# Altium project PRJ_SiAlarmV1.PrjPcb
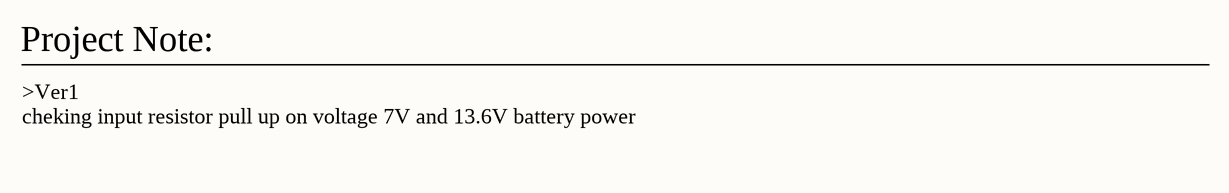
[diagram p0: ProjectNote1.SchDoc]
7 sheets, 31 parts. Net scope: flat (ports and power ports of the same name join across sheets).
Board file: pcb_SiAlarmV1.PcbDoc
Sheets:
  ProjectNote1.SchDoc
  sch_audio.SchDoc
  sch_io.SchDoc
  sch_gsm.SchDoc
  sch_controller.SchDoc
  sch_power.SchDoc
  SiAlarm_BlockDiagram.SchDoc

## Sheet ProjectNote1.SchDoc
size 241 x 381 mm; SheetNumber: 1; SheetTotal: 6

### Notes on the sheet
- Project Note:
- >Ver1
  cheking input resistor pull up on voltage 7V and 13.6V battery power
- Note:

## Sheet sch_audio.SchDoc
size B; SheetNumber: 2; SheetTotal: 7
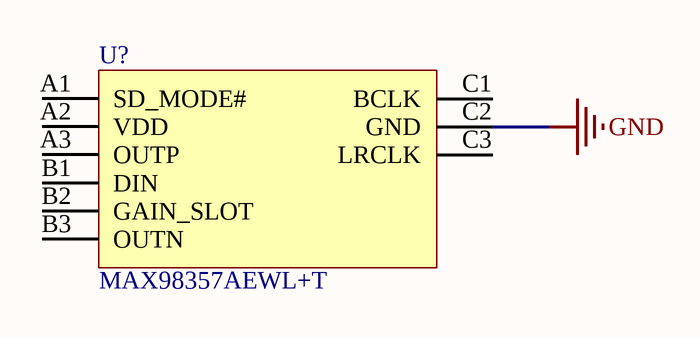
[diagram p1: sch_audio.SchDoc]

### Parts
(Parts that share a designator on the sheet are numbered #1, #2 ... from top to bottom, then left to right.)
U?#1  MAX98357AEWL+T  [WLP-9_L1.4-W1.3-P0.40-R3-C3-BR]

### Nets
GND: U?#1.C2(GND)

Not connected (* = marked no-connect by the designer): U?#1 A1(SD_MODE#) A2(VDD) A3(OUTP) B1(DIN) B2(GAIN_SLOT) B3(OUTN) C1(BCLK) C3(LRCLK)

### Library data of the parts
U?#1 = MAX98357AEWL+T: JLC: C2682619; MFAC: MAX98357AEWL+T

## Sheet sch_io.SchDoc
size B; SheetNumber: 3; SheetTotal: 7
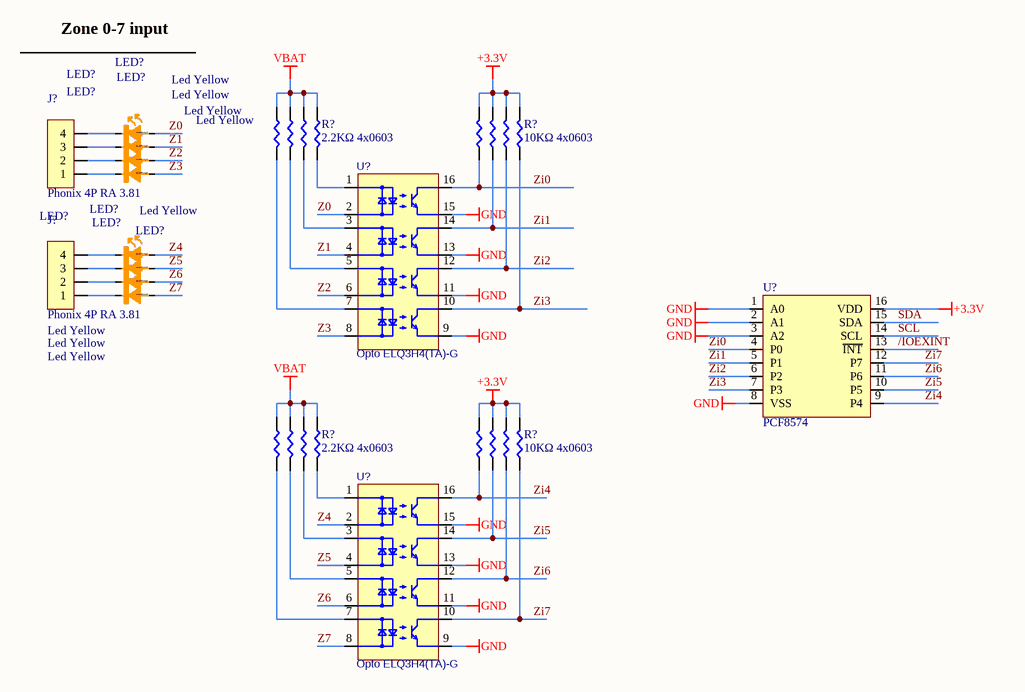
[diagram p2: sch_io.SchDoc]

### Parts
(Parts that share a designator on the sheet are numbered #1, #2 ... from top to bottom, then left to right.)
J?#1  Phonix 4P RA 3.81  [TER4-R-3.81]
J?#2  Phonix 4P RA 3.81  [TER4-R-3.81]
LED?#1  Led Yellow  [LED0603Y]
LED?#2  Led Yellow  [LED0603Y]
LED?#3  Led Yellow  [LED0603Y]
LED?#4  Led Yellow  [LED0603Y]
LED?#5  Led Yellow  [LED0603Y]
LED?#6  Led Yellow  [LED0603Y]
LED?#7  Led Yellow  [LED0603Y]
LED?#8  Led Yellow  [LED0603Y]
R?#1  2.2KΩ 4x0603  [0603ARRAY]
R?#2  10KΩ 4x0603  [0603ARRAY]
R?#3  2.2KΩ 4x0603  [0603ARRAY]
R?#4  10KΩ 4x0603  [0603ARRAY]
U?#2  Opto ELQ3H4(TA)-G  [SOP-16_L10.3-W4.4-P1.27-LS7.0-BL]
U?#3  PCF8574  [SOIC-16_L10.3-W7.5-P1.27-LS10.3-BL]
U?#4  Opto ELQ3H4(TA)-G  [SOP-16_L10.3-W4.4-P1.27-LS7.0-BL]

### Nets
+3.3V: R?#2.5(R5) R?#2.6(R6) R?#2.7(R7) R?#2.8(R8) R?#4.5(R5) R?#4.6(R6) R?#4.7(R7) R?#4.8(R8) U?#3.16(VDD)
GND: U?#2.9(EMI1) U?#2.11(EMI2) U?#2.13(EMI3) U?#2.15(EMI4) U?#3.1(A0) U?#3.2(A1) U?#3.3(A2) U?#3.8(VSS) U?#4.9(EMI1) U?#4.11(EMI2) U?#4.13(EMI3) U?#4.15(EMI4)
VBAT: R?#1.5(R5) R?#1.6(R6) R?#1.7(R7) R?#1.8(R8) R?#3.5(R5) R?#3.6(R6) R?#3.7(R7) R?#3.8(R8)
/IOEXINT: U?#3.13(~{INT})
SCL: U?#3.14(SCL)
SDA: U?#3.15(SDA)
Z0: LED?#1.A U?#2.2(C-A1)
Z1: LED?#2.A U?#2.4(C-A2)
Z2: LED?#3.A U?#2.6(C-A3)
Z3: LED?#4.A U?#2.8(C-A4)
Z4: LED?#5.A U?#4.2(C-A1)
Z5: LED?#6.A U?#4.4(C-A2)
Z6: LED?#7.A U?#4.6(C-A3)
Z7: LED?#8.A U?#4.8(C-A4)
Zi0: R?#2.4(R4) U?#2.16(COL4) U?#3.4(P0)
Zi1: R?#2.3(R3) U?#2.14(COL3) U?#3.5(P1)
Zi2: R?#2.2(R2) U?#2.12(CO2) U?#3.6(P2)
Zi3: R?#2.1(R1) U?#2.10(COL1) U?#3.7(P3)
Zi4: R?#4.4(R4) U?#3.9(P4) U?#4.16(COL4)
Zi5: R?#4.3(R3) U?#3.10(P5) U?#4.14(COL3)
Zi6: R?#4.2(R2) U?#3.11(P6) U?#4.12(CO2)
Zi7: R?#4.1(R1) U?#3.12(P7) U?#4.10(COL1)
NetJ?#1_1: J?#1.1 LED?#4.K
NetJ?#1_2: J?#1.2 LED?#3.K
NetJ?#1_3: J?#1.3 LED?#2.K
NetJ?#1_4: J?#1.4 LED?#1.K
NetJ?#2_1: J?#2.1 LED?#8.K
NetJ?#2_2: J?#2.2 LED?#7.K
NetJ?#2_3: J?#2.3 LED?#6.K
NetJ?#2_4: J?#2.4 LED?#5.K
NetR?#1_1: R?#1.1(R1) U?#2.7(A-C4)
NetR?#1_2: R?#1.2(R2) U?#2.5(A-C3)
NetR?#1_3: R?#1.3(R3) U?#2.3(A-C2)
NetR?#1_4: R?#1.4(R4) U?#2.1(A-C1)
NetR?#3_1: R?#3.1(R1) U?#4.7(A-C4)
NetR?#3_2: R?#3.2(R2) U?#4.5(A-C3)
NetR?#3_3: R?#3.3(R3) U?#4.3(A-C2)
NetR?#3_4: R?#3.4(R4) U?#4.1(A-C1)

### Notes on the sheet
- Zone 0-7 input
- (in symbol LedYellow) @DesignPCB

### Library data of the parts
J?#1 J?#2 = Phonix 4P RA: MFAC: DB2ERC-3.81-4P-GN; JLC: C395698
LED?#1-LED?#8 = LedYellow: MFAC: XL-1608UWC-04; JLC: C965808
R?#1 R?#3 = R2.2K Array: MFAC: 4D03WGJ0222T5E; JLC: C12001
R?#2 R?#4 = R10K Array: MFAC: 4D03WGJ0103T5E; JLC: C29718
U?#2 U?#4 = ELQ3H4(TA)-G: JLC: C150957; MFAC: ELQ3H4(TA)-G
U?#3 = PCF8574: MFAC: PCF8574T/3,518; JLC: C7605

## Sheet sch_gsm.SchDoc
size B; SheetNumber: 4; SheetTotal: 7
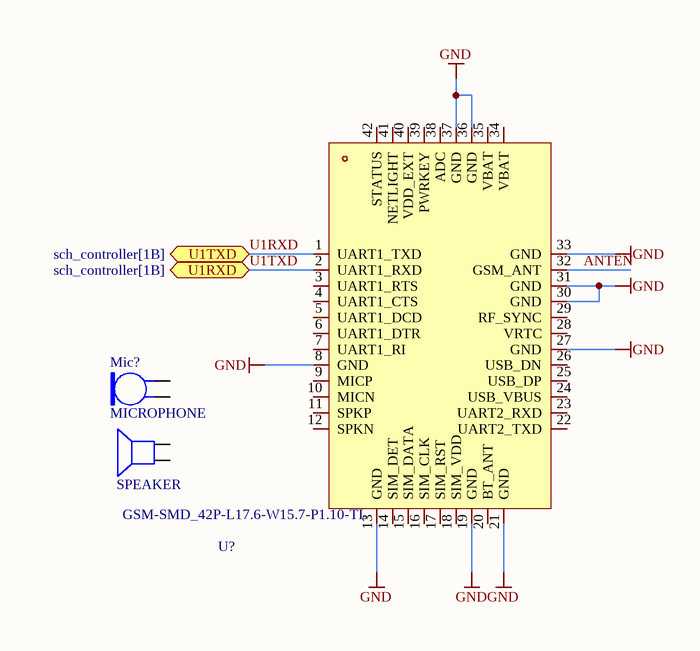
[diagram p3: sch_gsm.SchDoc]

### Parts
(Parts that share a designator on the sheet are numbered #1, #2 ... from top to bottom, then left to right.)
?  SPEAKER
Mic?  MICROPHONE  [Model Name]
U?#5  GSM-SMD_42P-L17.6-W15.7-P1.10-TL  [GSM-SMD_42P-L17.6-W15.7-P1.10-TL]

### Ports
U1RXD (bidir, see sch_controller[1B]), U1TXD (bidir, see sch_controller[1B])

### Nets
GND: U?#5.8(GND) U?#5.13(GND) U?#5.19(GND) U?#5.21(GND) U?#5.27(GND) U?#5.30(GND) U?#5.31(GND) U?#5.33(GND) U?#5.36(GND) U?#5.37(GND)
ANTEN: U?#5.32(GSM_ANT)
U1RXD: U?#5.1(UART1_TXD) ; port U1TXD
U1TXD: U?#5.2(UART1_RXD) ; port U1RXD  [project net U1RXD]

Not connected (* = marked no-connect by the designer): ? 1 2; Mic? 1 2; U?#5 3(UART1_RTS) 4(UART1_CTS) 5(UART1_DCD) 6(UART1_DTR) 7(UART1_RI) 9(MICP) 10(MICN) 11(SPKP) 12(SPKN) 14(SIM_DET) 15(SIM_DATA) 16(SIM_CLK) 17(SIM_RST) 18(SIM_VDD) 20(BT_ANT) 22(UART2_TXD) 23(UART2_RXD) 24(USB_VBUS) 25(USB_DP) 26(USB_DN) 28(VRTC) 29(RF_SYNC) 34(VBAT) 35(VBAT) 38(ADC) 39(PWRKEY) 40(VDD_EXT) 41(NETLIGHT) 42(STATUS)

### Library data of the parts
U?#5 = SIM800C_C2981431: MFAC: SIM800C; JLC: C2981431

## Sheet sch_controller.SchDoc
size B; SheetNumber: 5; SheetTotal: 7
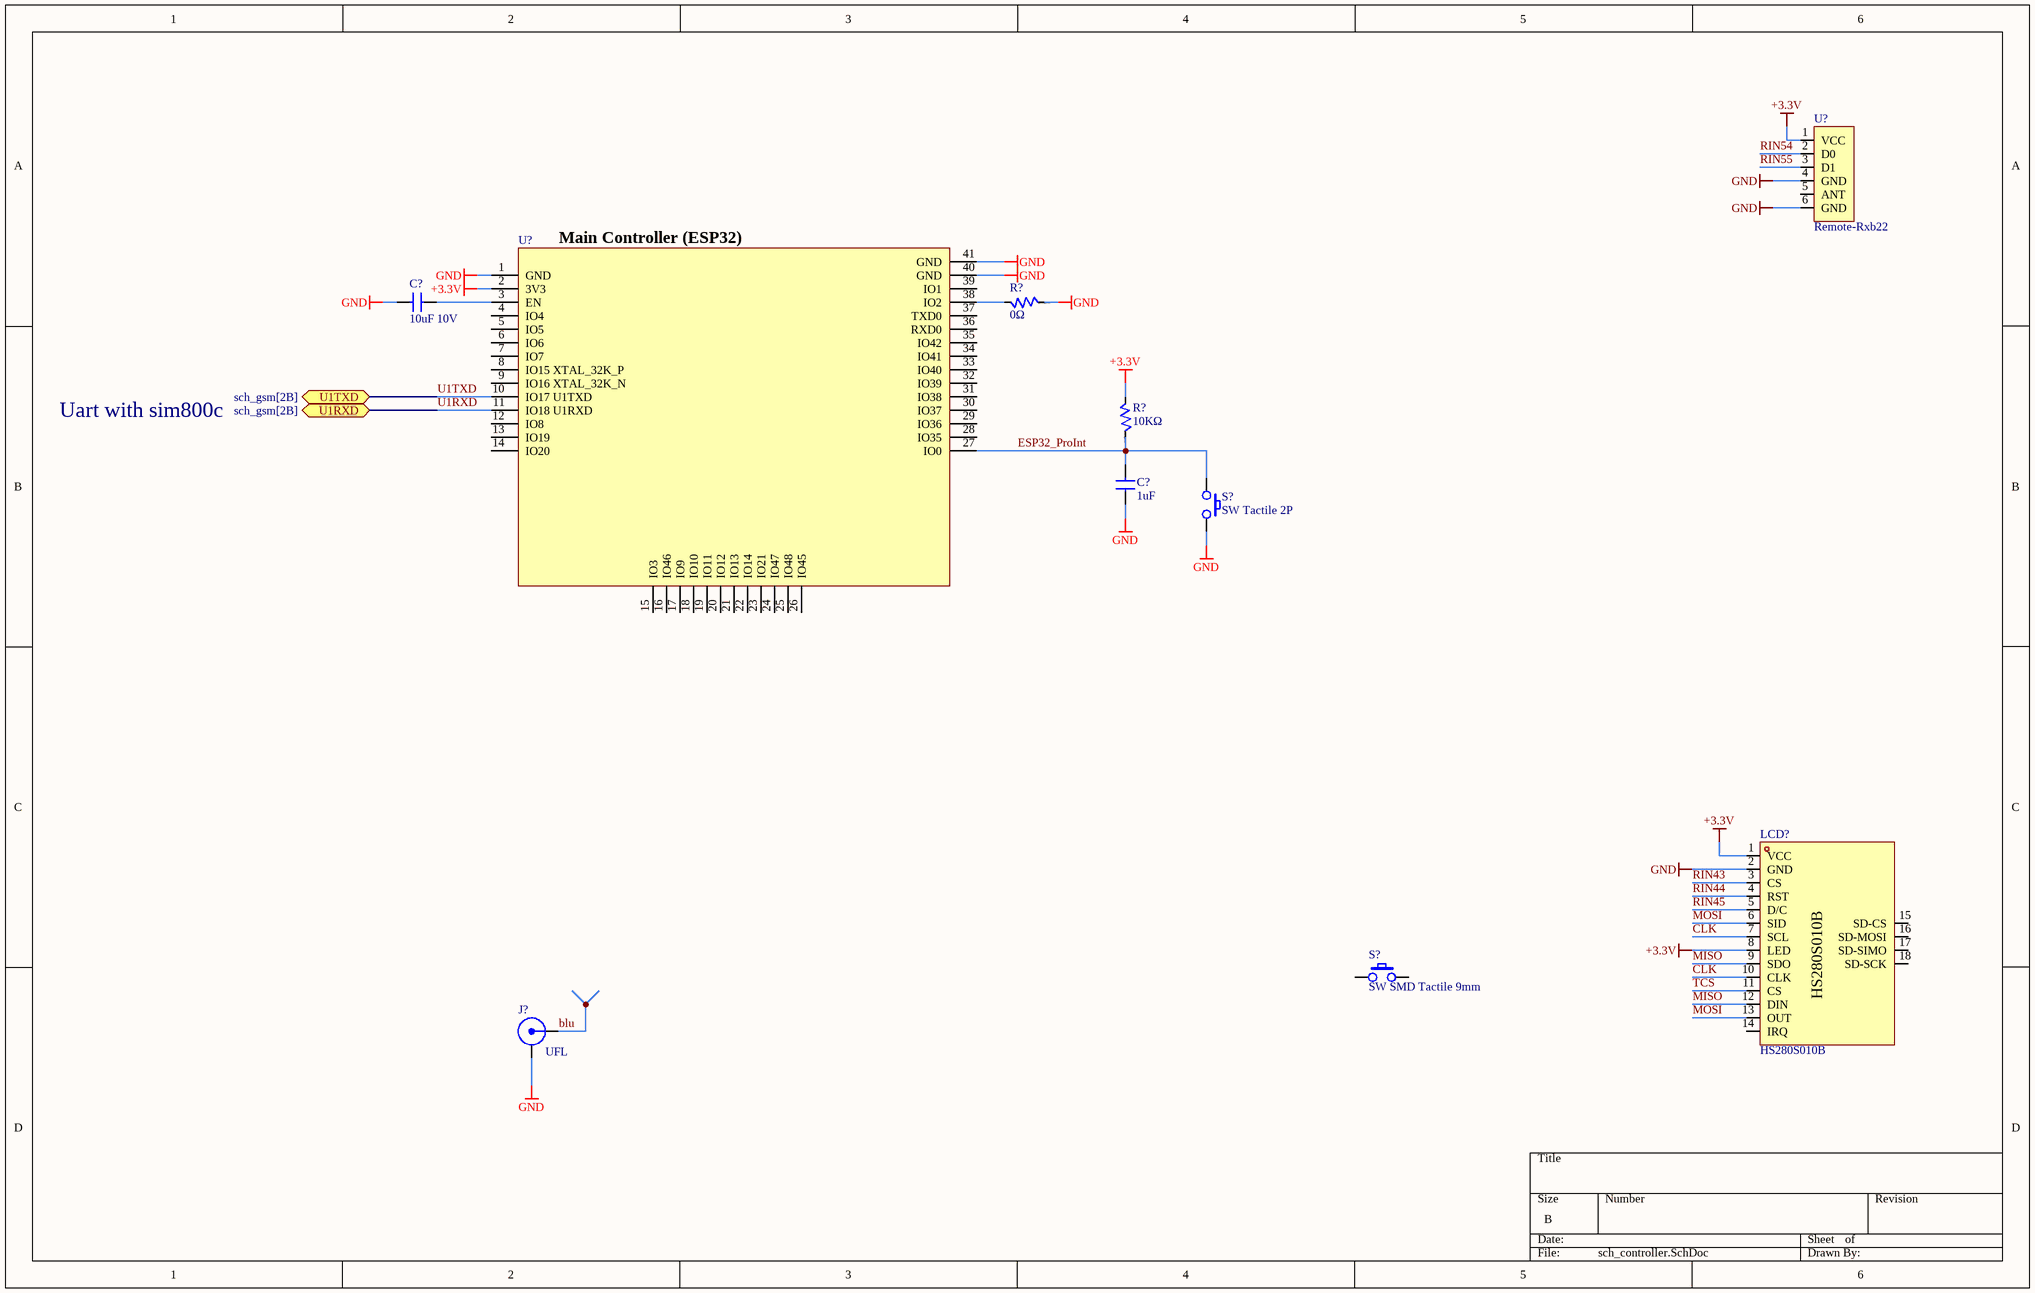
[diagram p4: sch_controller.SchDoc]

### Parts
(Parts that share a designator on the sheet are numbered #1, #2 ... from top to bottom, then left to right.)
C?#1  10uF 10V  [0603]
C?#2  1uF  [0402]
J?#3  UFL  [UFL]
LCD?  HS280S010B  [LCD-TH_HS280S010B]
R?#5  0Ω  [0603]
R?#6  10KΩ  [0402]
S?#1  SW Tactile 2P  [SW-SMD_L6.0-W3.3-LS8.0]
S?#2  SW SMD Tactile 9mm  [SW SMD_4P-L4.5-W4.5-P3.00-LS7.0]
U?#6  Remote-Rxb22  [remote-rxb22-433]
U?#7  (no value)  [WIRELM-SMD_ESP32-S3-WROOM-1U]

### Ports
U1RXD (bidir, see sch_gsm[2B]), U1TXD (bidir, see sch_gsm[2B])

### Nets
+3.3V: LCD?.1(VCC) LCD?.8(LED) R?#6.2 U?#6.1(VCC) U?#7.2(3V3)
GND: C?#1.2 C?#2.2 J?#3.2 LCD?.2(GND) R?#5.1 S?#1.1 U?#6.4(GND) U?#6.6(GND) U?#7.1(GND) U?#7.40(GND) U?#7.41(GND)
blu: J?#3.1
CLK: LCD?.7(SCL) LCD?.10(CLK)
ESP32_ProInt: C?#2.1 R?#6.1 S?#1.2 U?#7.27(IO0)
MISO: LCD?.9(SDO) LCD?.12(DIN)
MOSI: LCD?.6(SID) LCD?.13(OUT)
RIN43: LCD?.3(CS)
RIN44: LCD?.4(RST)
RIN45: LCD?.5(D/C)
RIN54: U?#6.2(D0)
RIN55: U?#6.3(D1)
TCS: LCD?.11(CS)
U1RXD: U?#7.11(IO18_U1RXD) ; port U1RXD
U1TXD: U?#7.10(IO17_U1TXD) ; port U1TXD  [project net U1RXD]
NetC?#1_1: C?#1.1 U?#7.3(EN)
NetR?#5_2: R?#5.2 U?#7.38(IO2)

Not connected (* = marked no-connect by the designer): LCD? 14(IRQ) 15(SD-CS) 16(SD-MOSI) 17(SD-SIMO) 18(SD-SCK); S?#2 1 2; U?#6 5(ANT); U?#7 4(IO4) 5(IO5) 6(IO6) 7(IO7) 8(IO15_XTAL_32K_P) 9(IO16_XTAL_32K_N) 12(IO8) 13(IO19) 14(IO20) 15(IO3) 16(IO46) 17(IO9) 18(IO10) 19(IO11) 20(IO12) 21(IO13) 22(IO14) 23(IO21) 24(IO47) 25(IO48) 26(IO45) 28(IO35) 29(IO36) 30(IO37) 31(IO38) 32(IO39) 33(IO40) 34(IO41) 35(IO42) 36(RXD0) 37(TXD0) 39(IO1)

### Notes on the sheet
- (near U?#7) Main Controller (ESP32)
- Uart with sim800c
- (in symbol R0R) @DesignPCB
- (in symbol R10K0402) @DesignPCB

### Library data of the parts
C?#1 = C10UF 10V: MFAC: CL10A106KP8NNNC; JLC: C19702
C?#2 = C1uF0402 25V: MFAC: CL05A105KA5NQNC; JLC: C52923
J?#3 = BNC
LCD? = LCD-TH_HS280S010B: MFAC: HS280S010B; JLC: C2939938
R?#5 = R0R: MFAC: 0603WAF0000T5E; JLC: C21189
R?#6 = R10K0402: MFAC: RC0402FR-0710KL; JLC: C60490
S?#1 = SW Tactile Reset 2P: MFAC: TS-1101-C-W; JLC: C318938
S?#2 = SW Push 9mm: MFAC: TS-1109S-C-L; JLC: C840835
U?#7 = ESP32-S3-WROOM-1U-N16R8: MFAC: ESP32-S3-WROOM-1U-N16R8; JLC: C3013946

## Sheet sch_power.SchDoc
size B; SheetNumber: 1; SheetTotal: 1

## Sheet SiAlarm_BlockDiagram.SchDoc
size D; SheetNumber: 7; SheetTotal: 7
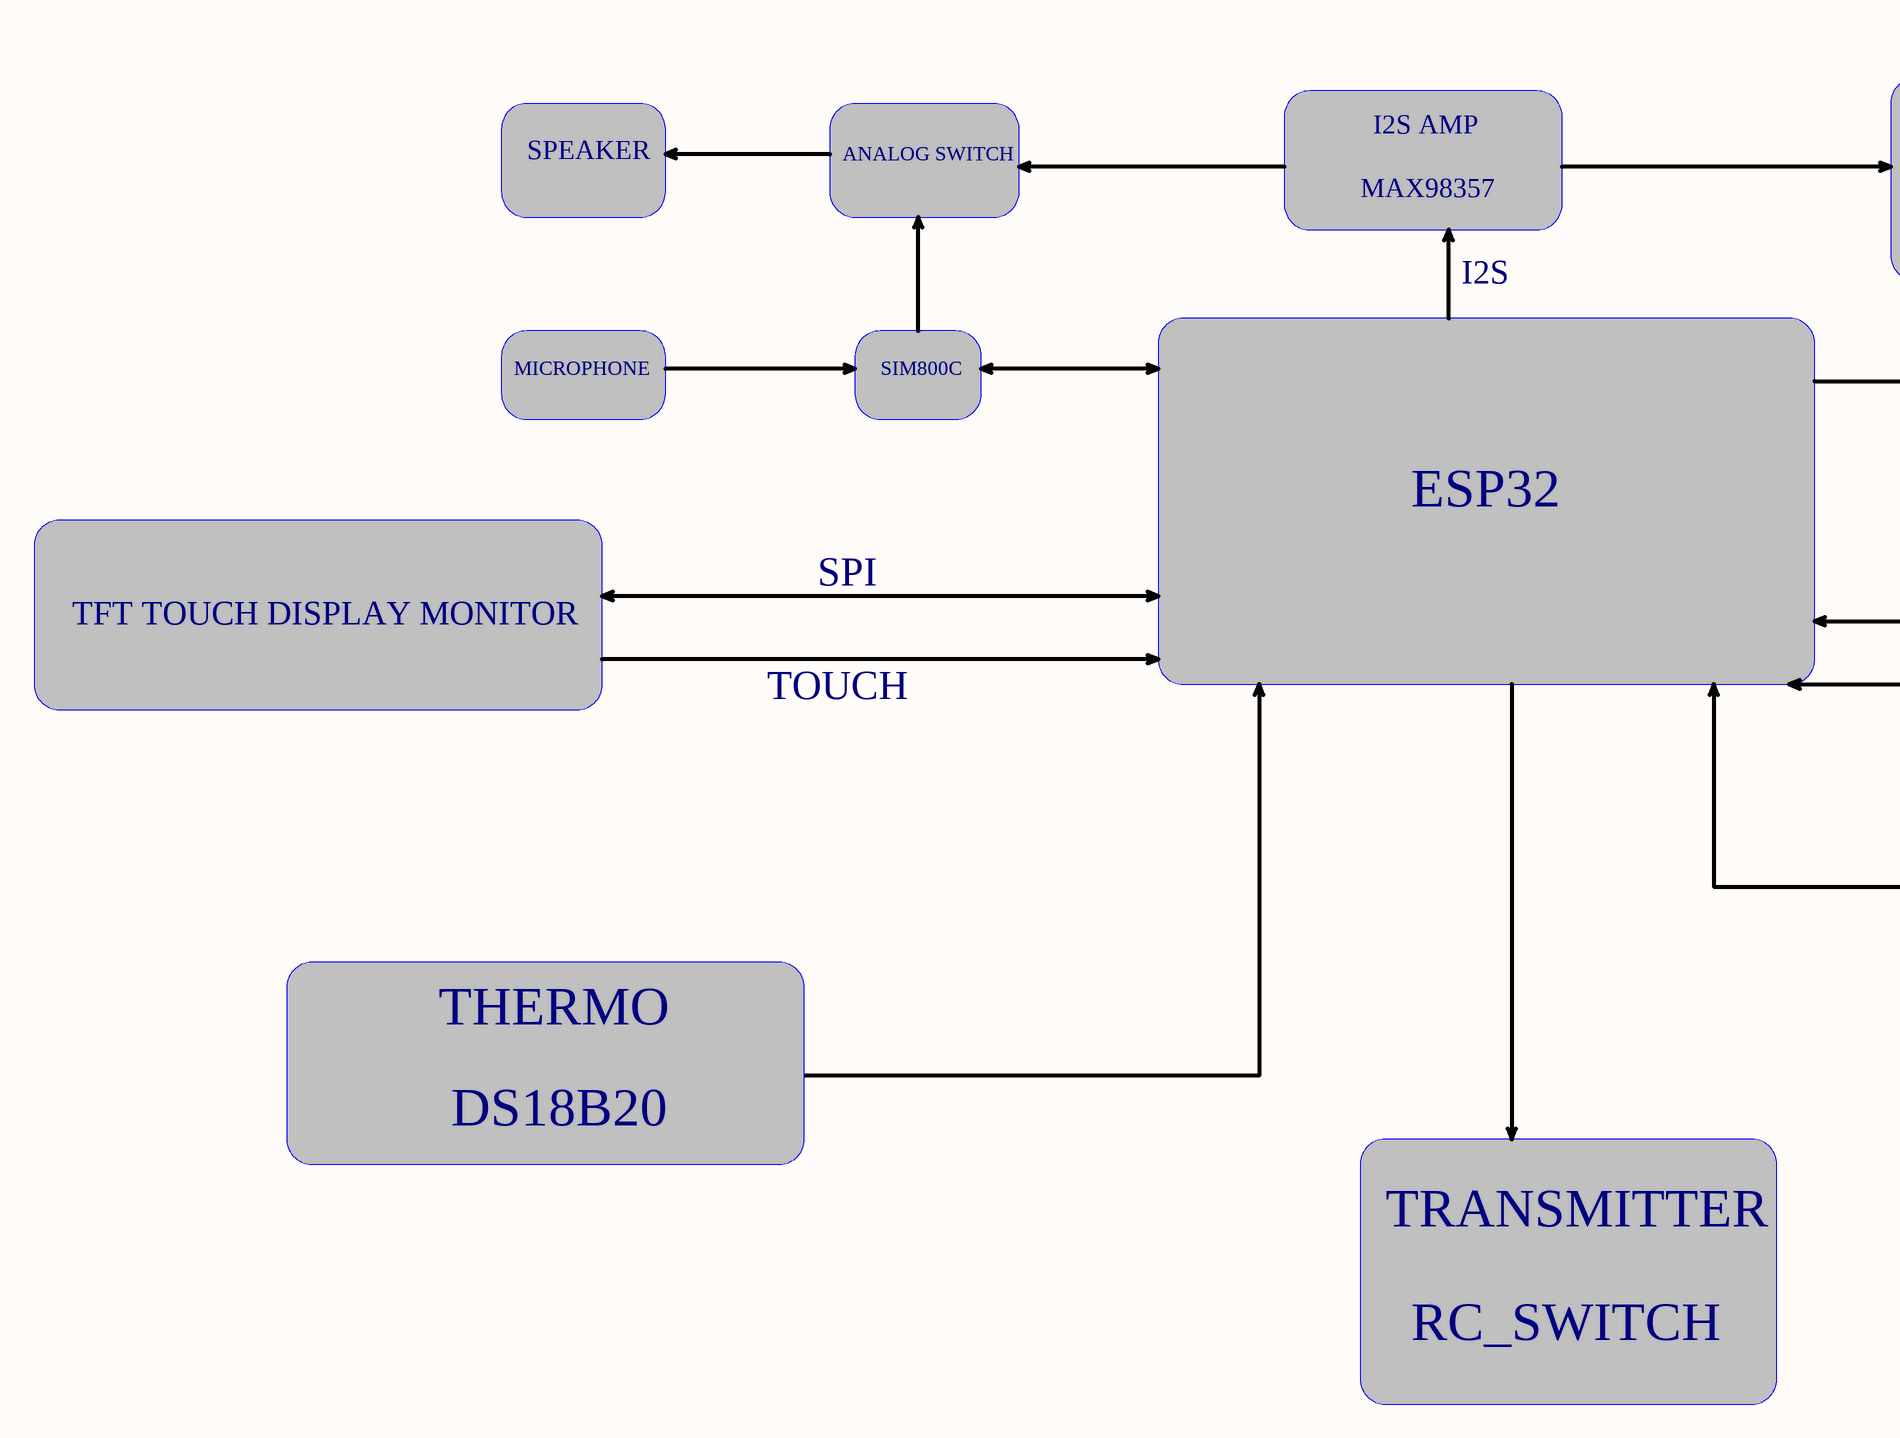
[diagram p5: SiAlarm_BlockDiagram.SchDoc, left]
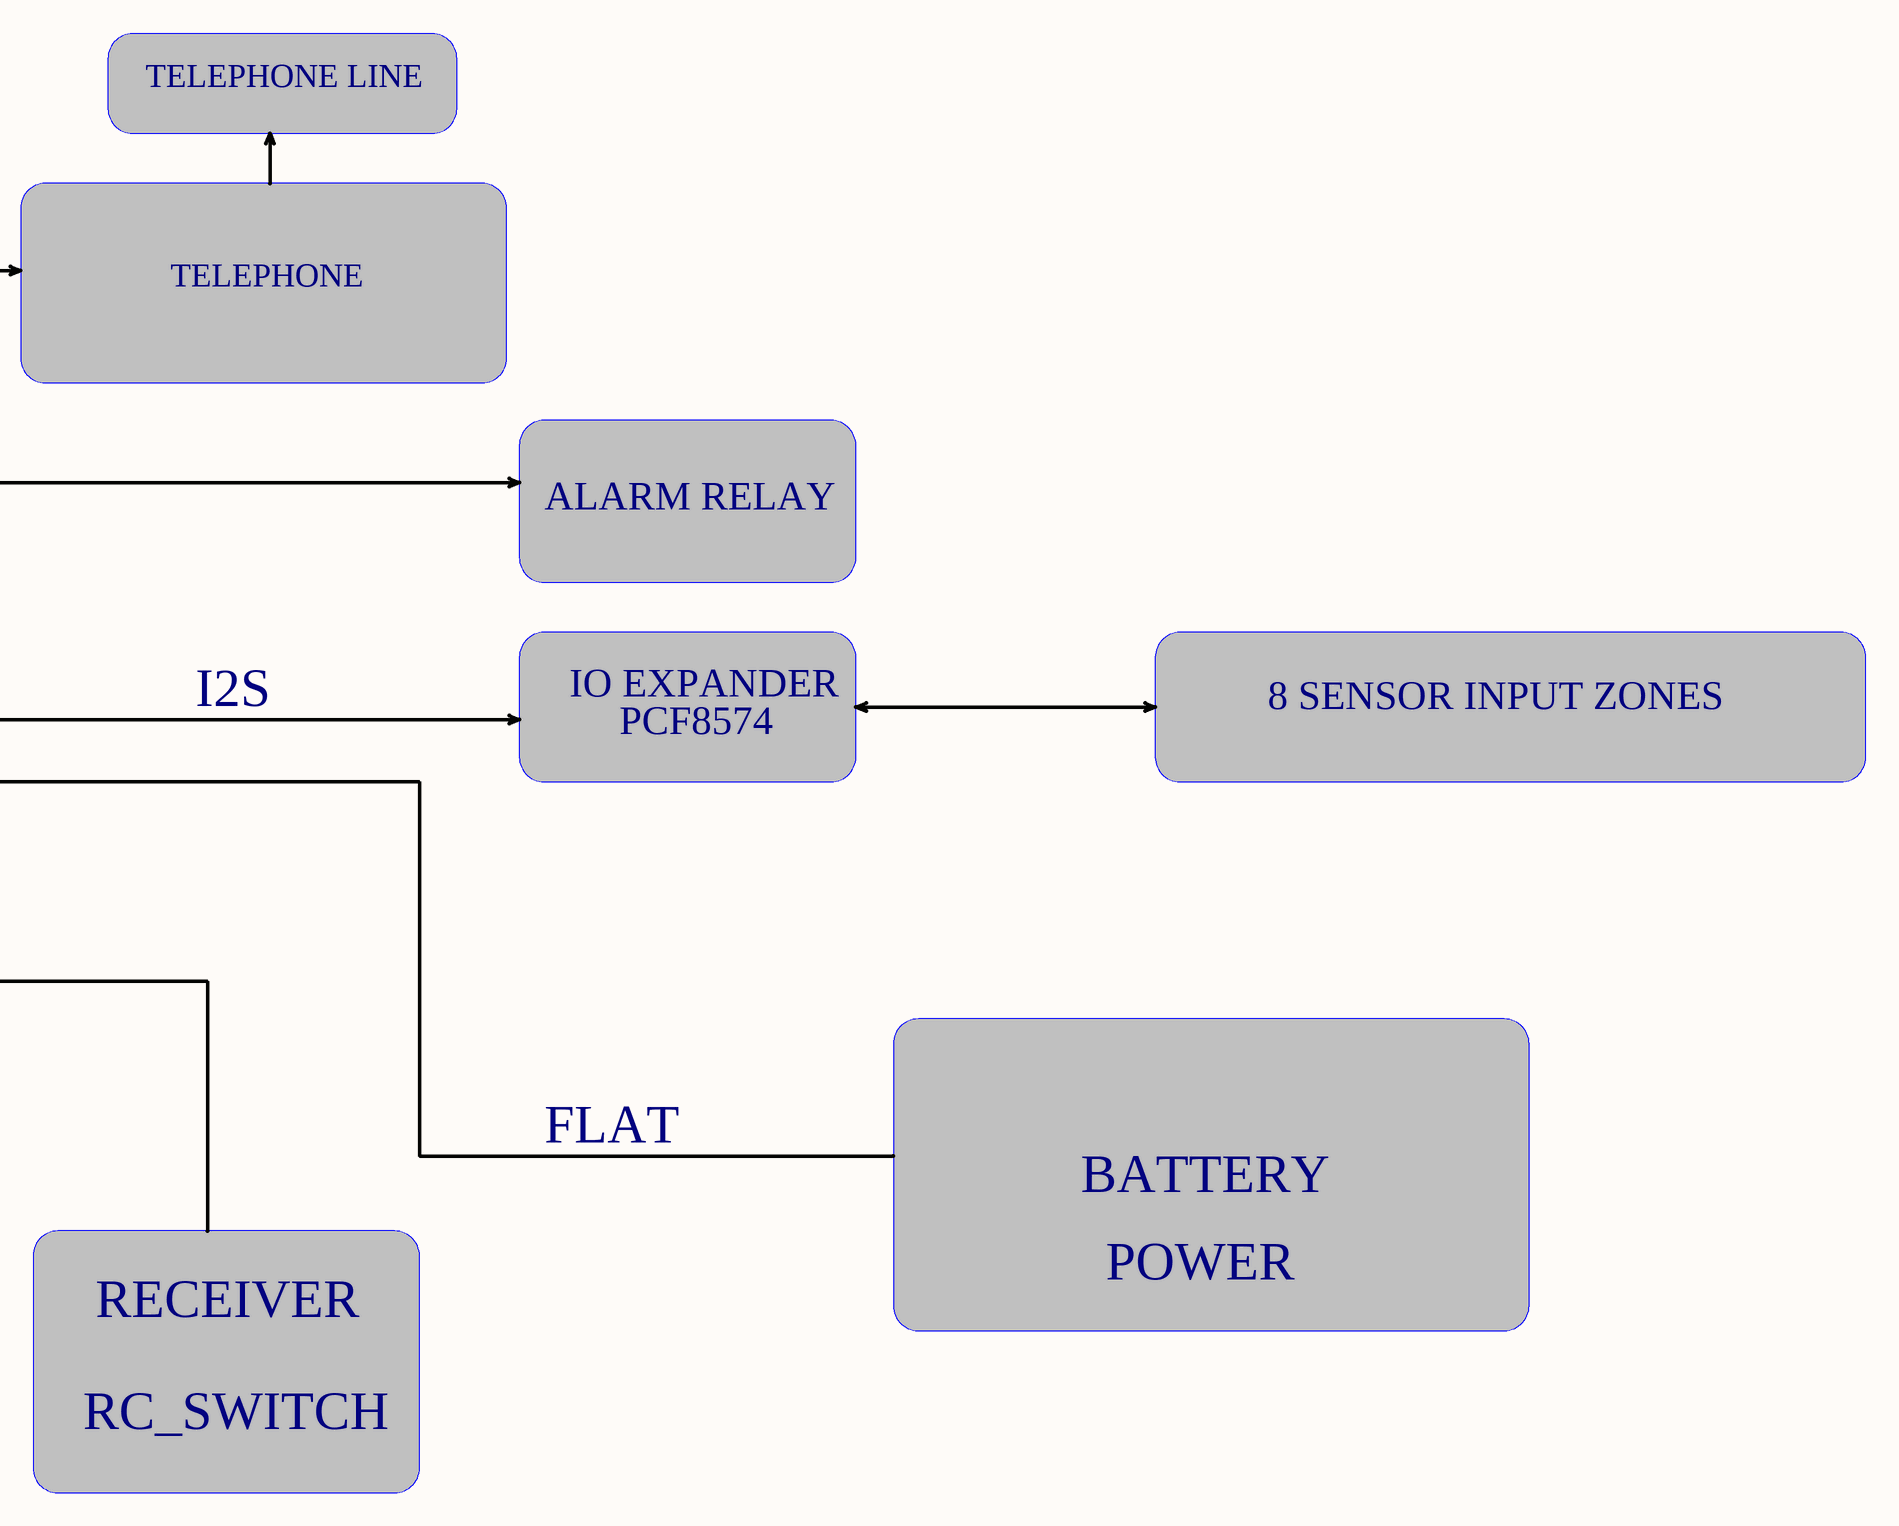
[diagram p6: SiAlarm_BlockDiagram.SchDoc, right]

### Notes on the sheet
- TELEPHONE LINE
- I2S AMP
- SPEAKER
- ANALOG SWITCH
- MAX98357
- TELEPHONE
- I2S
- MICROPHONE
- SIM800C
- ALARM RELAY
- ESP32
- TFT TOUCH DISPLAY MONITOR
- SPI
- IO EXPANDER
- PCF8574
- 8 SENSOR INPUT ZONES
- TOUCH
- THERMO
- FLAT
- DS18B20
- BATTERY
- POWER
- TRANSMITTER
- RECEIVER
- RC_SWITCH

## Nets that join several sheets
+3.3V: sch_io (9 pins), sch_controller (5 pins)
GND: sch_audio (U?#1.C2), sch_io (12 pins), sch_gsm (10 pins), sch_controller (11 pins)
U1RXD: sch_gsm (U?#5.1), sch_controller (U?#7.10)
U1RXD: sch_gsm (U?#5.2), sch_controller (U?#7.11)